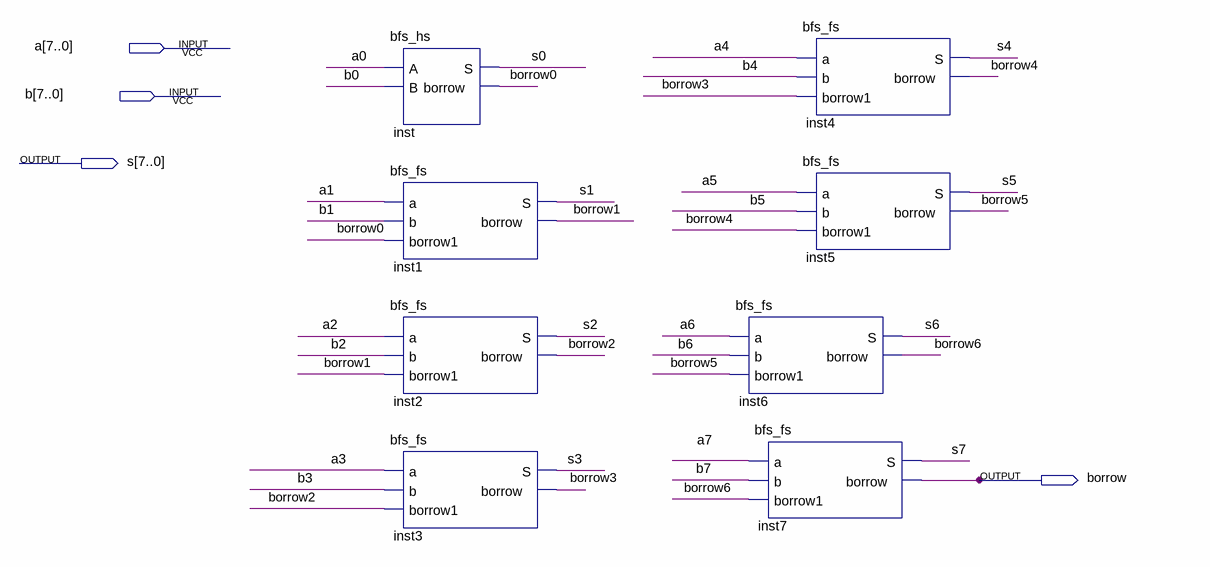
[diagram p0: schematic sheet]
// Quartus schematic bfs_subtrator.bdf as structural Verilog: 8 symbols, 4 pins
module bfs_subtrator (
  input  [7:0] a,
  input  [7:0] b,
  output [7:0] s,
  output borrow
);

  wire borrow0, borrow1, borrow2, borrow3, borrow4, borrow5, borrow6;

  bfs_hs inst (.A(a[0]), .B(b[0]), .S(s[0]), .borrow(borrow0));
  bfs_fs inst1 (.a(a[1]), .b(b[1]), .borrow1(borrow0), .S(s[1]), .borrow(borrow1));
  bfs_fs inst2 (.a(a[2]), .b(b[2]), .borrow1(borrow1), .S(s[2]), .borrow(borrow2));
  bfs_fs inst3 (.a(a[3]), .b(b[3]), .borrow1(borrow2), .S(s[3]), .borrow(borrow3));
  bfs_fs inst6 (.a(a[6]), .b(b[6]), .borrow1(borrow5), .S(s[6]), .borrow(borrow6));
  bfs_fs inst4 (.a(a[4]), .b(b[4]), .borrow1(borrow3), .S(s[4]), .borrow(borrow4));
  bfs_fs inst5 (.a(a[5]), .b(b[5]), .borrow1(borrow4), .S(s[5]), .borrow(borrow5));
  bfs_fs inst7 (.a(a[7]), .b(b[7]), .borrow1(borrow6), .S(s[7]), .borrow(borrow));
endmodule
